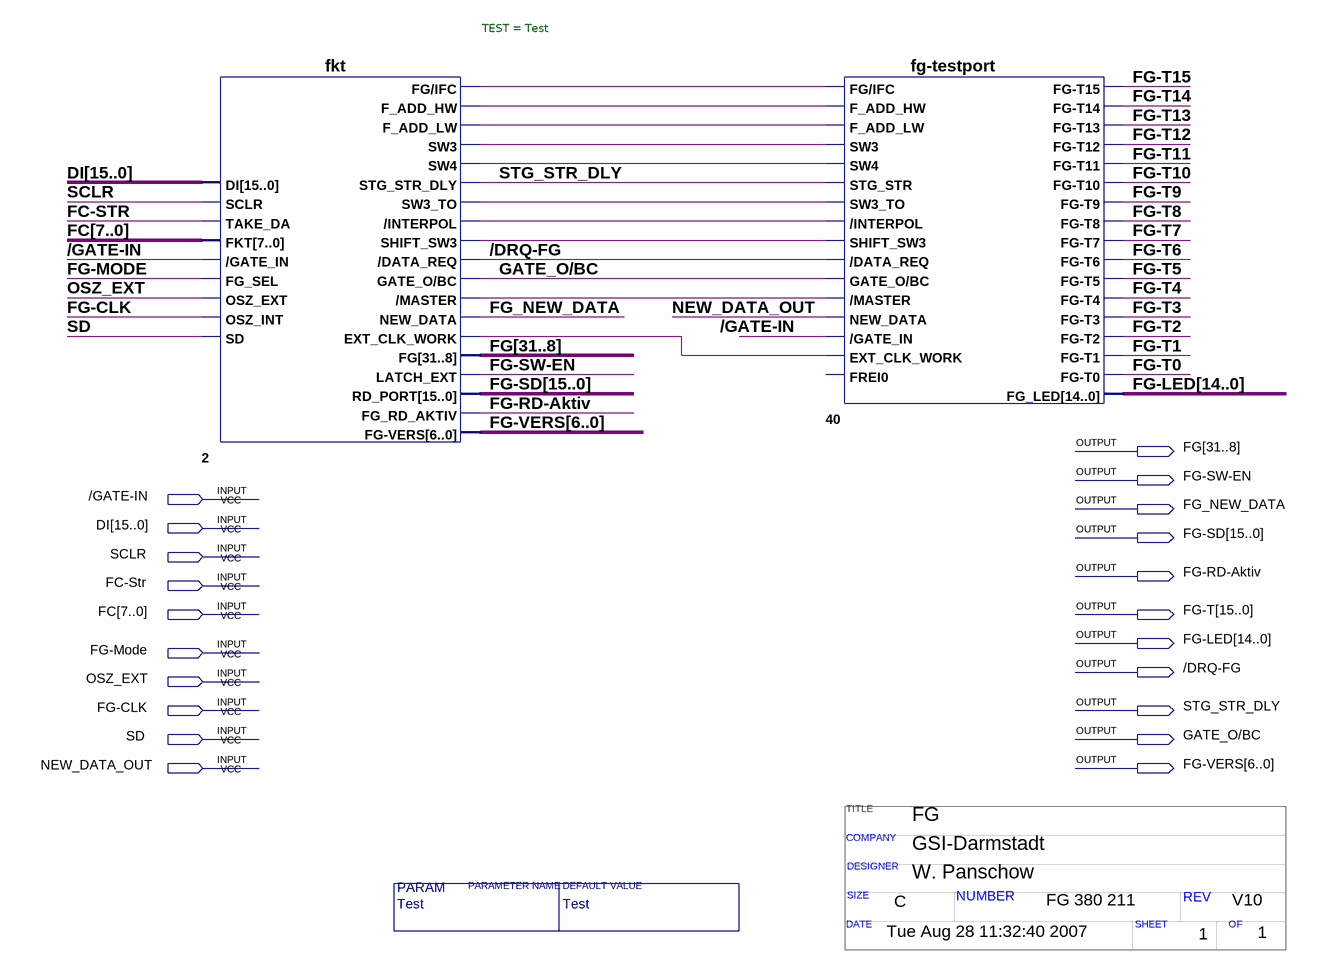
[diagram p0: schematic sheet]
// Quartus schematic fg.bdf as structural Verilog: 2 symbols, 21 pins
// Title block: TITLE: FG; COMPANY: GSI-Darmstadt; DESIGNER: W. Panschow; SIZE: C; NUMBER: FG 380 211; REV: V10; DATE: Tue Aug 28 11:32:40 2007; SHEET: 1; OF: 1
module fg #(parameter Test = "Test") (
  input  \/GATE-IN ,
  input  [15:0] DI,
  input  SCLR,
  input  \FC-Str ,
  input  [7:0] FC,
  input  \FG-Mode ,
  input  OSZ_EXT,
  input  \FG-CLK ,
  input  SD,
  input  NEW_DATA_OUT,
  output [31:8] FG,
  output \FG-SW-EN ,
  output FG_NEW_DATA,
  output [15:0] \FG-SD ,
  output \FG-RD-Aktiv ,
  output [15:0] \FG-T ,
  output [14:0] \FG-LED ,
  output \/DRQ-FG ,
  output STG_STR_DLY,
  output \GATE_O/BC ,
  output [6:0] \FG-VERS 
);

  wire n2__interpol, n2__master, n2_ext_clk_work, n2_f_add_hw, n2_f_add_lw, n2_fg_ifc, n2_shift_sw3, n2_sw3,
       n2_sw3_to, n2_sw4;

  fkt #(.TEST(Test)) u_2 (
    .DI(DI), .SCLR(SCLR), .TAKE_DA(\FC-Str ), .FKT(FC), .\/GATE_IN (\/GATE-IN ), .FG_SEL(\FG-Mode ),
    .OSZ_EXT(OSZ_EXT), .OSZ_INT(\FG-CLK ), .SD(SD), .\FG/IFC (n2_fg_ifc), .F_ADD_HW(n2_f_add_hw),
    .F_ADD_LW(n2_f_add_lw), .SW3(n2_sw3), .SW4(n2_sw4), .STG_STR_DLY(STG_STR_DLY), .SW3_TO(n2_sw3_to),
    .\/INTERPOL (n2__interpol), .SHIFT_SW3(n2_shift_sw3), .\/DATA_REQ (\/DRQ-FG ), .\GATE_O/BC (\GATE_O/BC ),
    .\/MASTER (n2__master), .NEW_DATA(FG_NEW_DATA), .EXT_CLK_WORK(n2_ext_clk_work), .FG(FG),
    .LATCH_EXT(\FG-SW-EN ), .RD_PORT(\FG-SD ), .FG_RD_AKTIV(\FG-RD-Aktiv ), .\FG-VERS (\FG-VERS ));
  \fg-testport  u_40 (
    .\FG/IFC (n2_fg_ifc), .F_ADD_HW(n2_f_add_hw), .F_ADD_LW(n2_f_add_lw), .SW3(n2_sw3), .SW4(n2_sw4),
    .STG_STR(STG_STR_DLY), .SW3_TO(n2_sw3_to), .\/INTERPOL (n2__interpol), .SHIFT_SW3(n2_shift_sw3),
    .\/DATA_REQ (\/DRQ-FG ), .\GATE_O/BC (\GATE_O/BC ), .\/MASTER (n2__master), .NEW_DATA(NEW_DATA_OUT),
    .\/GATE_IN (\/GATE-IN ), .EXT_CLK_WORK(n2_ext_clk_work), .\FG-T15 (\FG-T [15]), .\FG-T14 (\FG-T [14]),
    .\FG-T13 (\FG-T [13]), .\FG-T12 (\FG-T [12]), .\FG-T11 (\FG-T [11]), .\FG-T10 (\FG-T [10]),
    .\FG-T9 (\FG-T [9]), .\FG-T8 (\FG-T [8]), .\FG-T7 (\FG-T [7]), .\FG-T6 (\FG-T [6]), .\FG-T5 (\FG-T [5]),
    .\FG-T4 (\FG-T [4]), .\FG-T3 (\FG-T [3]), .\FG-T2 (\FG-T [2]), .\FG-T1 (\FG-T [1]), .\FG-T0 (\FG-T [0]),
    .FG_LED(\FG-LED ));  // open: FREI0
endmodule
